# Altium schematic sheet SoilMoistureSensor.SchDoc: Soil Moisture Sensor
size 431 x 279 mm; Date: 5/9/22; Author: Christian Martinez; CompanyName: UW-Madison; SheetNumber: 1; SheetTotal: 1; ENG_APP_DATE: --/--/--; DSN_APP_DATE: --/--/--; CHK_APP_DATE: --/--/--
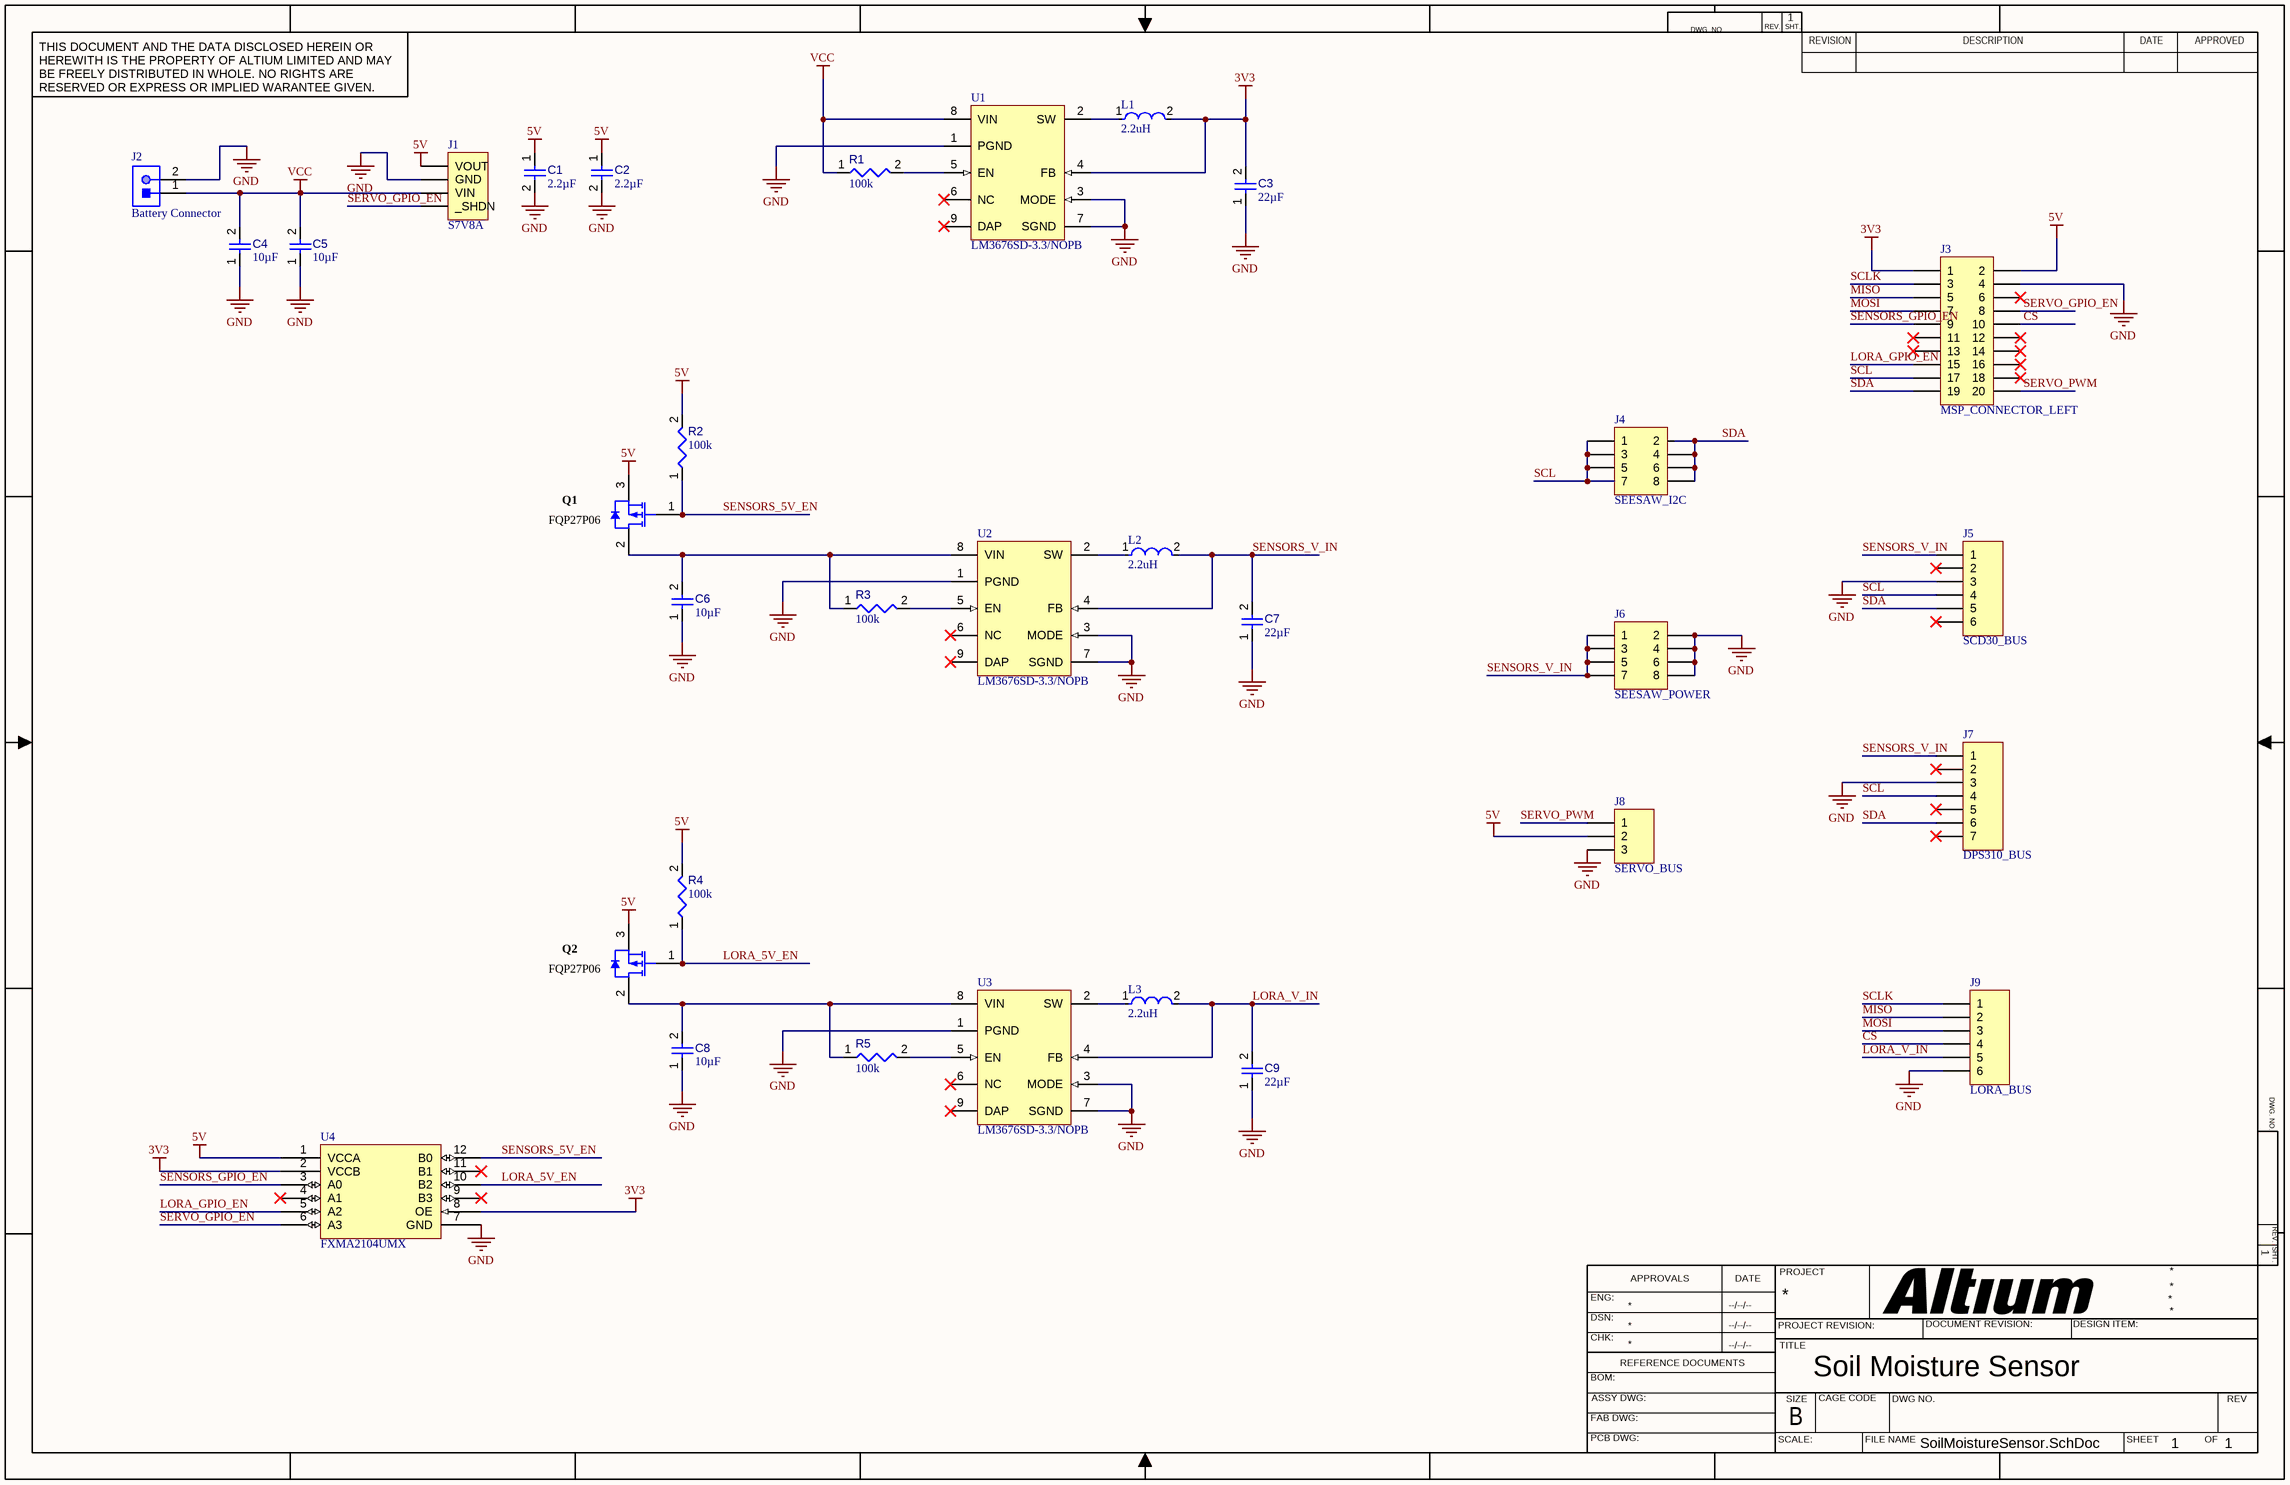
[diagram p0: SoilMoistureSensor.SchDoc]

## Parts
C1  value 2.2µF  [CAPC0402(1005)60_L]  (hidden comment: Capacitor 2,2µF +/-20% 10V 0402)
C2  value 2.2µF  [CAPC0402(1005)60_L]  (hidden comment: Capacitor 2,2µF +/-20% 10V 0402)
C3  value 22µF  [CAPC0805(2012)145_L]  (hidden comment: Capacitor 22µF +/-40% 16V 0805)
C4  value 10µF  [CAPC0805(2012)145_L]  (hidden comment: Capacitor 10µF +/-20% 25V 0805)
C5  value 10µF  [CAPC0805(2012)145_L]  (hidden comment: Capacitor 10µF +/-20% 25V 0805)
C6  value 10µF  [CAPC0805(2012)145_L]  (hidden comment: Capacitor 10µF +/-20% 25V 0805)
C7  value 22µF  [CAPC0805(2012)145_L]  (hidden comment: Capacitor 22µF +/-40% 16V 0805)
C8  value 10µF  [CAPC0805(2012)145_L]  (hidden comment: Capacitor 10µF +/-20% 25V 0805)
C9  value 22µF  [CAPC0805(2012)145_L]  (hidden comment: Capacitor 22µF +/-40% 16V 0805)
J1  S7V8A  [HDR1X4]
J2  Battery Connector  [JST-S2B-PH-K-S_V]
J3  MSP_CONNECTOR_LEFT  [HDR2X10]
J4  SEESAW_I2C  [HDR2X4]
J5  SCD30_BUS  [HDR1X6]
J6  SEESAW_POWER  [HDR2X4]
J7  DPS310_BUS  [HDR1X7]
J8  SERVO_BUS  [HDR1X3]
J9  LORA_BUS  [HDR1X6]
L1  2.2uH  [FP-NRH2412-MFG]
L2  2.2uH  [FP-NRH2412-MFG]
L3  2.2uH  [FP-NRH2412-MFG]
Q1  FQP27P06  [FAIR-TO-220-3]
Q2  FQP27P06  [FAIR-TO-220-3]
R1  value 100k  [RESC2013X70X40ML20T20]  (hidden comment: Resistor 100k +/-1% 0805 125 mW)
R2  value 100k  [RESC2013X70X40ML20T20]  (hidden comment: Resistor 100k +/-1% 0805 125 mW)
R3  value 100k  [RESC2013X70X40ML20T20]  (hidden comment: Resistor 100k +/-1% 0805 125 mW)
R4  value 100k  [RESC2013X70X40ML20T20]  (hidden comment: Resistor 100k +/-1% 0805 125 mW)
R5  value 100k  [RESC2013X70X40ML20T20]  (hidden comment: Resistor 100k +/-1% 0805 125 mW)
U1  LM3676SD-3.3/NOPB  [NGQ0008A_V]
U2  LM3676SD-3.3/NOPB  [NGQ0008A_V]
U3  LM3676SD-3.3/NOPB  [NGQ0008A_V]
U4  FXMA2104UMX  [QFN40P160X160X50-12N]

## Nets
3V3: C3.2 J3.1 L1.2 U1.4(FB) U4.2(VCCB) U4.8(OE)
5V: C1.1 C2.1 J1.1(VOUT) J3.2 J8.2 Q1.3(S) Q2.3(S) R2.2 R4.2 U4.1(VCCA)
GND: C1.2 C2.2 C3.1 C4.1 C5.1 C6.1 C7.1 C8.1 C9.1 J1.2(GND) J2.2 J3.4 J5.3 J6.2 J6.4 J6.6 J6.8 J7.3 J8.3 J9.6 U1.1(PGND) U1.3(MODE) U1.7(SGND) U2.1(PGND) U2.3(MODE) U2.7(SGND) U3.1(PGND) U3.3(MODE) U3.7(SGND) U4.7(GND)
VCC: C4.2 C5.2 J1.3(VIN) J2.1 R1.1 U1.8(VIN)
CS: J3.10 J9.4
LORA_5V_EN: Q2.1(G) R4.1 U4.10(B2)
LORA_GPIO_EN: J3.15 U4.5(A2)
LORA_V_IN: C9.2 J9.5 L3.2 U3.4(FB)
MISO: J3.5 J9.2
MOSI: J3.7 J9.3
SCL: J3.17 J4.1 J4.3 J4.5 J4.7 J5.4 J7.4
SCLK: J3.3 J9.1
SDA: J3.19 J4.2 J4.4 J4.6 J4.8 J5.5 J7.6
SENSORS_5V_EN: Q1.1(G) R2.1 U4.12(B0)
SENSORS_GPIO_EN: J3.9 U4.3(A0)
SENSORS_V_IN: C7.2 J5.1 J6.1 J6.3 J6.5 J6.7 J7.1 L2.2 U2.4(FB)
SERVO_GPIO_EN: J1.4(_SHDN) J3.8 U4.6(A3)
SERVO_PWM: J3.20 J8.1
NetC6_2: C6.2 Q1.2(D) R3.1 U2.8(VIN)
NetC8_2: C8.2 Q2.2(D) R5.1 U3.8(VIN)
NetL1_1: L1.1 U1.2(SW)
NetL2_1: L2.1 U2.2(SW)
NetL3_1: L3.1 U3.2(SW)
NetR1_2: R1.2 U1.5(EN)
NetR3_2: R3.2 U2.5(EN)
NetR5_2: R5.2 U3.5(EN)

Not connected (* = marked no-connect by the designer): J3 6* 11* 12* 13* 14* 16* 18*; J5 2* 6*; J7 2* 5* 7*; U1 6(NC)* 9(DAP)*; U2 6(NC)* 9(DAP)*; U3 6(NC)* 9(DAP)*; U4 4(A1)* 9(B3)* 11(B1)*

## Notes on the sheet
- DWG. NO.
- REV.
- SHT.
- THIS DOCUMENT AND THE DATA DISCLOSED HEREIN OR HEREWITH IS THE PROPERTY OF ALTIUM LIMITED AND MAY BE FREELY DISTRIBUTED IN WHOLE. NO RIGHTS ARE RESERVED OR EXPRESS OR IMPLIED WARANTEE GIVEN.
- REVISION
- DESCRIPTION
- DATE
- APPROVED
- ENG:
- APPROVALS
- PROJECT
- DSN:
- CHK:
- REFERENCE DOCUMENTS
- PROJECT REVISION:
- TITLE
- DOCUMENT REVISION:
- DESIGN ITEM:
- BOM:
- FAB DWG:
- PCB DWG:
- ASSY DWG:
- SCALE:
- SIZE
- B
- CAGE CODE
- FILE NAME
- DWG NO.
- SHEET
- OF
- REV

## Library data of the parts
C1 C2 = CMP-001-00056-4: Chip Capacitor, 2,2µF +/-20%, 10V, 0402, Thickness 0.6 mm; Tolerance: 10%; Mounting Technology: SMT; Max Operating Temperature: 85°C; Case/Package: 0402; Pins: 2; Min Operating Temperature: -55°C; Voltage Rating: 10V
C3 C7 C9 = CMP-001-00081-4: Chip Capacitor, 22µF +/-40%, 16V, 0805, Thickness 1.45 mm; Tolerance: 5%; Voltage Rating: 16V; Mounting Technology: SMT; Pins: 2; Max Operating Temperature: 85°C; Case/Package: 0805; Min Operating Temperature: -55°C
C4-C6 C8 = CMP-001-00079-4: Chip Capacitor, 10µF +/-20%, 25V, 0805, Thickness 1.45 mm; Tolerance: 10%; Max Operating Temperature: 85°C; Case/Package: 0805; Voltage Rating: 25V; Min Operating Temperature: -55°C; Mounting Technology: SMT; Pins: 2
J1 = Header 4: Header, 4-Pin; LatestRevisionDate: 17-Jul-2002; LatestRevisionNote: Re-released for DXP Platform.; Publisher: Altium Limited
J2 = CMP-002-00030-2: Male Header, Pitch 2 mm, 1 x 2 Position, Height 4.8 mm, Tail Length 3.4 mm, -25 to 85 degC, RoHS, Bulk; Manufacturer: Japan Solderless Terminals; Package Reference: S2B-PH-K-S; Case/Package: S2B-PH-K-S; Datasheet URL: http://www.jst-mfg.com/product/pdf/eng/ePH.pdf; RoHS Compliant: Unknown; Datasheet Version: Dec-12; Gender: Male; Min Operating Temperature: -25°C; Max Operating Temperature: 85°C; Package Description: Male Header, Pitch 2 mm, 1 x 2 Position, Height 4.8 mm, Tail Length 3.4 mm; Connector Type: Header; Mounting Technology: SM
J3 = Header 10X2: Header, 10-Pin, Dual row; LatestRevisionDate: 17-Jul-2002; LatestRevisionNote: Re-released for DXP Platform.; Publisher: Altium Limited
J4 J6 = Header 4X2: Header, 4-Pin, Dual row; LatestRevisionDate: 17-Jul-2002; LatestRevisionNote: Re-released for DXP Platform.; Publisher: Altium Limited
J5 J9 = Header 6: Header, 6-Pin; LatestRevisionDate: 17-Jul-2002; LatestRevisionNote: Re-released for DXP Platform.; Publisher: Altium Limited
J7 = Header 7: Header, 7-Pin; LatestRevisionDate: 17-Jul-2002; LatestRevisionNote: Re-released for DXP Platform.; Publisher: Altium Limited
J8 = Header 3: Header, 3-Pin; LatestRevisionDate: 17-Jul-2002; LatestRevisionNote: Re-released for DXP Platform.; Publisher: Altium Limited
L1-L3 = CMP-14484-000657-1: Shielded Wirewound Inductor 2.2uH 20% 1.19A 0.168Ω SMD; Test Frequency: 100kHz; Self Resonant Frequency: 72MHz; Saturation Current: 1.7A; Current Rating: 1A; DC Resistance (DCR): 140mR; Core Material: Ferrite; Height - Seated (Max): 0.047inch; Halogen Free: Halogen Free; Package Quantity: 2500; Mount: Surface Mount; Max DC Current: 1.7A; Shielding: Shielded; Length: 0.095inch; Case/Package: Nonstandard; Height: 1.2mm; Inductance: 2.2uH; Width: 0.095inch; Min Operating Temperature: -25°C; Tolerance: 20%; RoHS Compliant: Yes; Packaging: Tape and Reel; Termination: SMD/SMT; Max Operating Temperature: 120°C
Q1 Q2 = CMP-2000-04936-1: P-Channel QFET(R) MOSFET, -60 V, -27 A, -55 to 175 degC, 3-Pin TO-220, RoHS, Tube; Manufacturer: Fairchild; Rated Power Dissipation: 120W; Qg Gate Charge: 33nC; Drain-Source On Resistance-Max: 0.07O; Drain-to-Source Voltage [Vdss]: 60V; Package Reference: TO-220; Datasheet URL: https://www.fairchildsemi.com/datasheets/FQ/FQP27P06.pdf; Datasheet Version: Mar-13; Package Description: 3-Pin Through Hole Device, Body 10 x 4.5 mm, Pitch 2.54 mm; Package URL: https://www.fairchildsemi.com/package-drawings/TO/TO220B03.pdf; Channel Type: P-Channel; Manufacturer URL: https://www.fairchildsemi.com/
R1-R5 = CMP-009-00024-5: Chip Resistor, 100 KOhm, +/- 1%, 0.125 W, -55 to 155 degC, 0805 (2012 Metric); Power: 125mW; Voltage Rating: 150V; Max Operating Temperature: 155°C; Mounting Technology: SM; RoHS Compliant: True; Tolerance: 1%; Case/Package: 0805; Min Operating Temperature: -55°C; Pins: 2
U1-U3 = CMP-0063-00744-3: 2MHz, 600mA Step-Down DC-DC Converter with Mode Control, 8-pin LLP, Pb-Free; Manufacturer: Texas Instruments; PowerWise: N; PackageTopMarking: ZXYTT*S010B; CompType: MiscPower; RoHS: Y; ComponentLink1URL: http://www.ti.com/general/docs/lit/getliterature.tsp?genericPartNumber=LM3676&fileType=pdf; ComponentLink1Description: Datasheet URL; PinCount: 8; PackageReference: NGQ0008A; PackageDescription: LLP, Plastic, Dual, 3 x 3 x 0.8mm Body, 8 Lead, 0.5mm Pitch, No Pullback